# Altium project Thunderscope_Rev4.1.PrjPCB (part 2 of 2)

## Sheet FPGA.SchDoc: ThunderScope 1000E
size A4; DrawnBy: Aleksa Bjelogrlic; Revision: 1
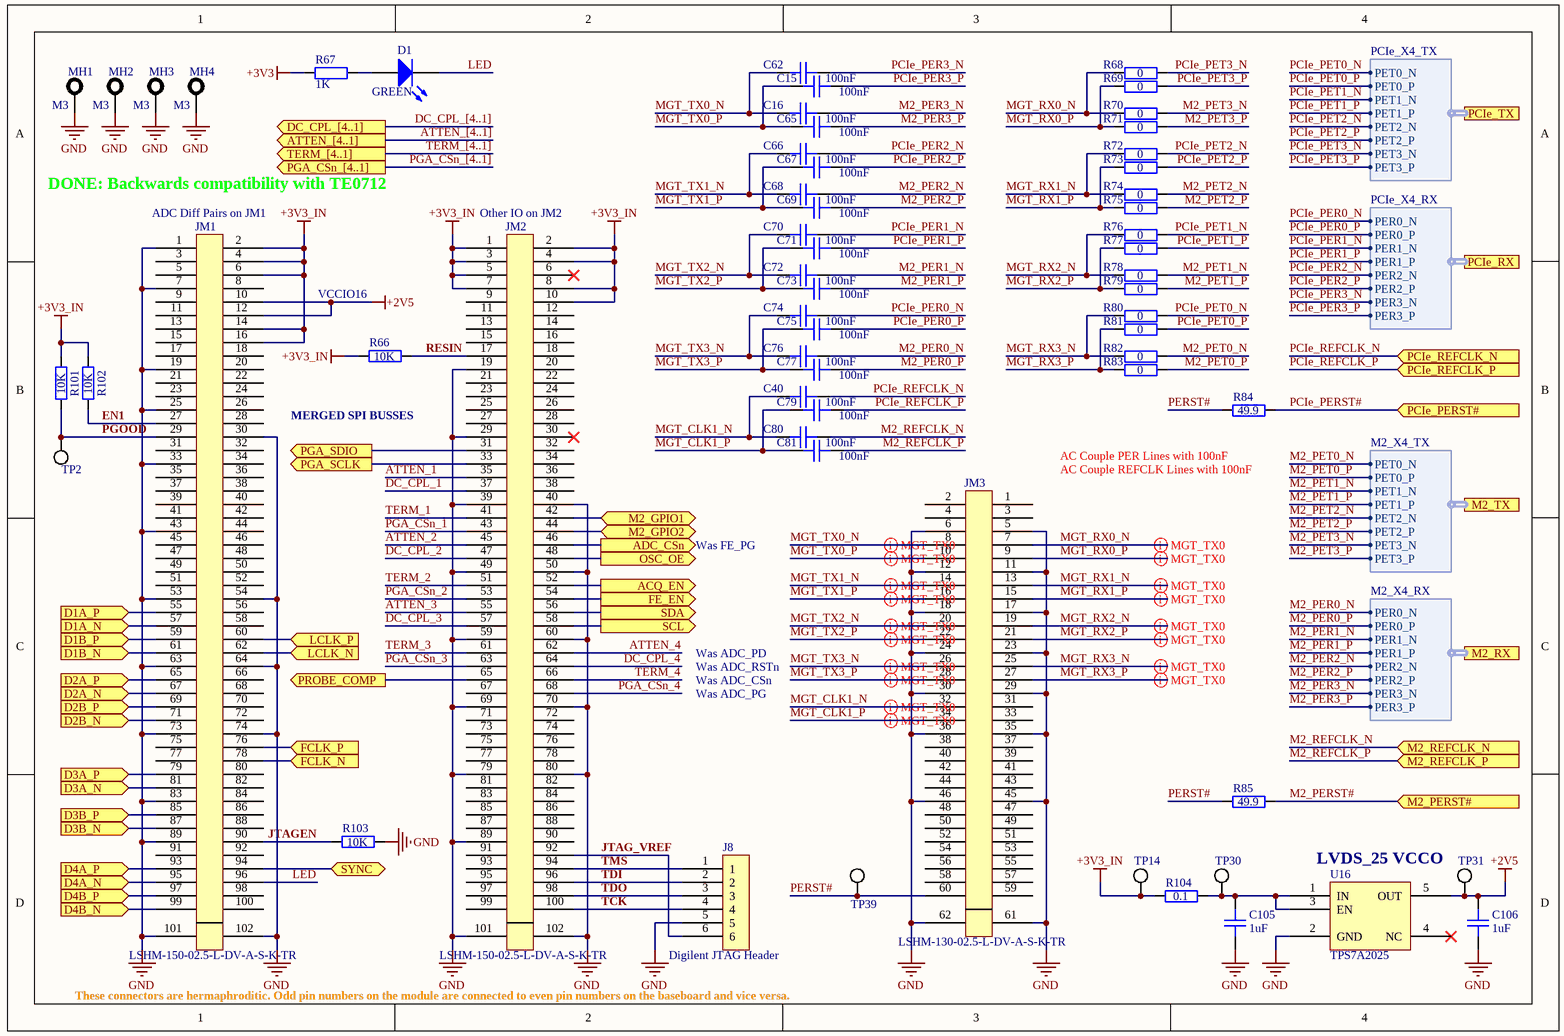
[diagram p5: FPGA.SchDoc]

### Parts
C15  100nF  [GEN_C_0201]
C16  100nF  [GEN_C_0201]
C40  100nF  [GEN_C_0201]
C62  100nF  [GEN_C_0201]
C65  100nF  [GEN_C_0201]
C66  100nF  [GEN_C_0201]
C67  100nF  [GEN_C_0201]
C68  100nF  [GEN_C_0201]
C69  100nF  [GEN_C_0201]
C70  100nF  [GEN_C_0201]
C71  100nF  [GEN_C_0201]
C72  100nF  [GEN_C_0201]
C73  100nF  [GEN_C_0201]
C74  100nF  [GEN_C_0201]
C75  100nF  [GEN_C_0201]
C76  100nF  [GEN_C_0201]
C77  100nF  [GEN_C_0201]
C79  100nF  [GEN_C_0201]
C80  100nF  [GEN_C_0201]
C81  100nF  [GEN_C_0201]
C105  1uF  [GEN_C_0402]
C106  1uF  [GEN_C_0402]
D1  GREEN  [LED_0603_LTST-S270K]
J8  2.54mm 6 Pin TH  [GEN_2.54mm_6_Pin_TH_RA]  (value not drawn)
JM1  LSHM-150-02.5-L-DV-A-S-K-TR  [SAM_LSHM-150-XX.X-XX-DV-A-S]
JM2  LSHM-150-02.5-L-DV-A-S-K-TR  [SAM_LSHM-150-XX.X-XX-DV-A-S]
JM3  LSHM-130-02.5-L-DV-A-S-K-TR  [SAM_LSHM-130-XX.X-XX-DV-A-S]
MH1  M3  [MH M3]  (no BOM)
MH2  M3  [MH M3]  (no BOM)
MH3  M3  [MH M3]  (no BOM)
MH4  M3  [MH M3]  (no BOM)
R66  10K  [GEN_R_0402]
R67  1K  [GEN_R_0402]
R68  0  [GEN_R_0201]
R69  0  [GEN_R_0201]
R70  0  [GEN_R_0201]
R71  0  [GEN_R_0201]
R72  0  [GEN_R_0201]
R73  0  [GEN_R_0201]
R74  0  [GEN_R_0201]
R75  0  [GEN_R_0201]
R76  0  [GEN_R_0201]
R77  0  [GEN_R_0201]
R78  0  [GEN_R_0201]
R79  0  [GEN_R_0201]
R80  0  [GEN_R_0201]
R81  0  [GEN_R_0201]
R82  0  [GEN_R_0201]
R83  0  [GEN_R_0201]
R84  49.9  [GEN_R_0402]
R85  49.9  [GEN_R_0402]
R101  10K  [GEN_R_0402]
R102  10K  [GEN_R_0402]
R103  10K  [GEN_R_0402]
R104  0.1  [GEN_R_0402]
TP2  PCB  [GEN_TP_PCB]  (value not drawn)  (no BOM)
TP14  PCB  [GEN_TP_PCB]  (value not drawn)  (no BOM)
TP30  PCB  [GEN_TP_PCB]  (value not drawn)  (no BOM)
TP31  PCB  [GEN_TP_PCB]  (value not drawn)  (no BOM)
TP39  PCB  [GEN_TP_PCB]  (value not drawn)  (no BOM)
U16  TPS7A2025  [GEN_SOT23_5_950_2900X1600X1450]

### Ports
ACQ_EN (out), ADC_CSn (out), ATTEN_[4..1] (out), D1A_N (in), D1A_P (in), D1B_N (in), D1B_P (in), D2A_N (in), D2A_P (in), D2B_N (in), D2B_P (in), D3A_N (in), D3A_P (in), D3B_N (in), D3B_P (in), D4A_N (in), D4A_P (in), D4B_N (in), D4B_P (in), DC_CPL_[4..1] (out), FCLK_N (in), FCLK_P (in), FE_EN (out), LCLK_N (in), LCLK_P (in), M2_GPIO1 (bidir), M2_GPIO2 (bidir), M2_PERST# (in), M2_REFCLK_N (in), M2_REFCLK_P (in), M2_RX (harness M2_X4_RX), M2_TX (harness M2_X4_TX), OSC_OE (out), PCIe_PERST# (in), PCIe_REFCLK_N (in), PCIe_REFCLK_P (in), PCIe_RX (harness PCIe_X4_RX), PCIe_TX (harness PCIe_X4_TX), PGA_CSn_[4..1] (out), PGA_SCLK (out), PGA_SDIO (out), PROBE_COMP (out), SCL (out), SDA (out), SYNC (bidir), TERM_[4..1] (out)

### Harnesses
PCIe_X4_RX: PER0_N, PER0_P, PER1_N, PER1_P, PER2_N, PER2_P, PER3_N, PER3_P
PCIe_X4_TX: PET0_N, PET0_P, PET1_N, PET1_P, PET2_N, PET2_P, PET3_N, PET3_P
M2_X4_RX: PER0_N, PER0_P, PER1_N, PER1_P, PER2_N, PER2_P, PER3_N, PER3_P
M2_X4_TX: PET0_N, PET0_P, PET1_N, PET1_P, PET2_N, PET2_P, PET3_N, PET3_P

### Nets
+2V5: C106.2 JM1.10 JM1.12 TP31.1 U16.5(OUT)
+3V3: R67.2
+3V3_IN: JM1.2 JM1.4 JM1.6 JM1.14 JM1.16 JM2.1 JM2.2 JM2.3 JM2.4 JM2.5 JM2.7 JM2.8 JM2.10 R66.2 R101.2 R102.2 R104.1 TP14.1
GND: C105.1 C106.1 J8.5 JM1.1 JM1.7 JM1.19 JM1.25 JM1.30 JM1.33 JM1.43 JM1.53 JM1.54 JM1.63 JM1.64 JM1.73 JM1.74 JM1.83 JM1.89 JM1.101 JM1.102 JM2.19 JM2.29 JM2.39 JM2.40 JM2.49 JM2.50 JM2.59 JM2.60 JM2.69 JM2.70 JM2.79 JM2.80 JM2.89 JM2.101 JM2.102 JM3.5 JM3.6 JM3.11 JM3.12 JM3.17 JM3.18 JM3.23 JM3.24 JM3.29 JM3.30 JM3.35 JM3.36 JM3.45 JM3.46 JM3.61 JM3.62 MH1.1 MH2.1 MH3.1 MH4.1 R103.1 U16.2(GND)
ACQ_EN: JM2.52 ; port ACQ_EN
ADC_CSn: JM2.46 ; port ADC_CSn
ADC_SCLK: JM2.33 ; port PGA_SCLK
ADC_SDATA: JM2.31 ; port PGA_SDIO
ATTEN_1: JM2.35
ATTEN_2: JM2.45
ATTEN_3: JM2.55
ATTEN_4: JM2.62
D1A_N: JM1.57 ; port D1A_N
D1A_P: JM1.55 ; port D1A_P
D1B_N: JM1.61 ; port D1B_N
D1B_P: JM1.59 ; port D1B_P
D2A_N: JM1.67 ; port D2A_N
D2A_P: JM1.65 ; port D2A_P
D2B_N: JM1.71 ; port D2B_N
D2B_P: JM1.69 ; port D2B_P
D3A_N: JM1.81 ; port D3A_N
D3A_P: JM1.79 ; port D3A_P
D3B_N: JM1.87 ; port D3B_N
D3B_P: JM1.85 ; port D3B_P
D4A_N: JM1.95 ; port D4A_N
D4A_P: JM1.93 ; port D4A_P
D4B_N: JM1.99 ; port D4B_N
D4B_P: JM1.97 ; port D4B_P
DC_CPL_1: JM2.37
DC_CPL_2: JM2.47
DC_CPL_3: JM2.57
DC_CPL_4: JM2.64
EN1: JM1.27 R102.1
FCLK_N: JM1.78 ; port FCLK_N
FCLK_P: JM1.76 ; port FCLK_P
FE_EN: JM2.54 ; port FE_EN
JTAG_VREF: J8.6 JM2.92
JTAGEN: JM1.90 R103.2
LCLK_N: JM1.62 ; port LCLK_N
LCLK_P: JM1.60 ; port LCLK_P
LED: D1.1(K) JM1.96
M2_GPIO1: JM2.42 ; port M2_GPIO1
M2_GPIO2: JM2.44 ; port M2_GPIO2
M2_PER0_N: C76.1 ; port M2_RX.PER0_N
M2_PER0_P: C77.1 ; port M2_RX.PER0_P
M2_PER1_N: C72.1 ; port M2_RX.PER1_N
M2_PER1_P: C73.1 ; port M2_RX.PER1_P
M2_PER2_N: C68.1 ; port M2_RX.PER2_N
M2_PER2_P: C69.1 ; port M2_RX.PER2_P
M2_PER3_N: C16.1 ; port M2_RX.PER3_N
M2_PER3_P: C65.1 ; port M2_RX.PER3_P
M2_PERST#: R85.2 ; port M2_PERST#
M2_PET0_N: R82.2 ; port M2_TX.PET0_N
M2_PET0_P: R83.2 ; port M2_TX.PET0_P
M2_PET1_N: R78.2 ; port M2_TX.PET1_N
M2_PET1_P: R79.2 ; port M2_TX.PET1_P
M2_PET2_N: R74.2 ; port M2_TX.PET2_N
M2_PET2_P: R75.2 ; port M2_TX.PET2_P
M2_PET3_N: R70.2 ; port M2_TX.PET3_N
M2_PET3_P: R71.2 ; port M2_TX.PET3_P
M2_REFCLK_N: C80.1 ; port M2_REFCLK_N
M2_REFCLK_P: C81.1 ; port M2_REFCLK_P
MGT_CLK1_N: C40.2 C80.2 JM3.32
MGT_CLK1_P: C79.2 C81.2 JM3.34
MGT_RX0_N: JM3.7 R68.1 R70.1
MGT_RX0_P: JM3.9 R69.1 R71.1
MGT_RX1_N: JM3.13 R72.1 R74.1
MGT_RX1_P: JM3.15 R73.1 R75.1
MGT_RX2_N: JM3.19 R76.1 R78.1
MGT_RX2_P: JM3.21 R77.1 R79.1
MGT_RX3_N: JM3.25 R80.1 R82.1
MGT_RX3_P: JM3.27 R81.1 R83.1
MGT_TX0_N: C16.2 C62.2 JM3.8
MGT_TX0_P: C15.2 C65.2 JM3.10
MGT_TX1_N: C66.2 C68.2 JM3.14
MGT_TX1_P: C67.2 C69.2 JM3.16
MGT_TX2_N: C70.2 C72.2 JM3.20
MGT_TX2_P: C71.2 C73.2 JM3.22
MGT_TX3_N: C74.2 C76.2 JM3.26
MGT_TX3_P: C75.2 C77.2 JM3.28
PCIe_PER0_N: C74.1 ; port PCIe_RX.PER0_N
PCIe_PER0_P: C75.1 ; port PCIe_RX.PER0_P
PCIe_PER1_N: C70.1 ; port PCIe_RX.PER1_N
PCIe_PER1_P: C71.1 ; port PCIe_RX.PER1_P
PCIe_PER2_N: C66.1 ; port PCIe_RX.PER2_N
PCIe_PER2_P: C67.1 ; port PCIe_RX.PER2_P
PCIe_PER3_N: C62.1 ; port PCIe_RX.PER3_N
PCIe_PER3_P: C15.1 ; port PCIe_RX.PER3_P
PCIe_PERST#: R84.2 ; port PCIe_PERST#
PCIe_PET0_N: R80.2 ; port PCIe_TX.PET0_N
PCIe_PET0_P: R81.2 ; port PCIe_TX.PET0_P
PCIe_PET1_N: R76.2 ; port PCIe_TX.PET1_N
PCIe_PET1_P: R77.2 ; port PCIe_TX.PET1_P
PCIe_PET2_N: R72.2 ; port PCIe_TX.PET2_N
PCIe_PET2_P: R73.2 ; port PCIe_TX.PET2_P
PCIe_PET3_N: R68.2 ; port PCIe_TX.PET3_N
PCIe_PET3_P: R69.2 ; port PCIe_TX.PET3_P
PCIe_REFCLK_N: C40.1 ; port PCIe_REFCLK_N
PCIe_REFCLK_P: C79.1 ; port PCIe_REFCLK_P
PERST#: JM3.60 R84.1 R85.1 TP39.1
PGA_CSn_1: JM2.43
PGA_CSn_2: JM2.53
PGA_CSn_3: JM2.63
PGA_CSn_4: JM2.68
PGOOD: JM1.29 R101.1 TP2.1
PLL_RSTn: JM2.48 ; port OSC_OE
PROBE_COMP: JM2.65 ; port PROBE_COMP
RESIN: JM2.17 R66.1
SCL: JM2.58 ; port SCL
SDA: JM2.56 ; port SDA
SYNC: JM1.94 ; port SYNC
TCK: J8.4 JM2.100
TDI: J8.2 JM2.96
TDO: J8.3 JM2.98
TERM_1: JM2.41
TERM_2: JM2.51
TERM_3: JM2.61
TERM_4: JM2.66
TMS: J8.1 JM2.94
NetC105_2: C105.2 R104.2 TP30.1 U16.1(IN) U16.3(EN)
NetD1_2: D1.2(A) R67.1

Not connected (* = marked no-connect by the designer): JM1 3 5 8 9 11 13 15 17 18 20 21 22 23 24 26 28 31 32 34 35 36 37 38 39 40 41 42 44 45 46 47 48 49 50 51 52 56 58 66 68 70 72 75 77 80 82 84 86 88 91 92 98 100; JM2 6* 9 11 12 13 14 15 16 18 20 21 22 23 24 25 26 27 28 30* 32 34 36 38 67 71 72 73 74 75 76 77 78 81 82 83 84 85 86 87 88 90 91 93 95 97 99; JM3 1 2 3 4 31 33 37 38 39 40 41 42 43 44 47 48 49 50 51 52 53 54 55 56 57 58 59; U16 4(NC)*

### Buses and harness runs
bus ATTEN_[4..1] = port ATTEN_[4..1]
bus DC_CPL_[4..1] = port DC_CPL_[4..1]
bus PGA_CSn_[4..1] = port PGA_CSn_[4..1]
bus TERM_[4..1] = port TERM_[4..1]

### Layout directives
differential pair; differential pair class PCIe: MGT_CLK1_N, MGT_CLK1_P, MGT_RX0_N, MGT_RX0_P, MGT_RX1_N, MGT_RX1_P, MGT_RX2_N, MGT_RX2_P, MGT_RX3_N, MGT_RX3_P, MGT_TX0_N, MGT_TX0_P, MGT_TX1_N, MGT_TX1_P, MGT_TX2_N, MGT_TX2_P, MGT_TX3_N, MGT_TX3_P

### Notes on the sheet
- DONE: Backwards compatibility with TE0712
- (near JM1) ADC Diff Pairs on JM1
- (near JM2) Other IO on JM2
- VCCIO16
- MERGED SPI BUSSES
- (near R84) AC Couple PER Lines with 100nF
- AC Couple REFCLK Lines with 100nF
- Was FE_PG
- Was ADC_PD
- Was ADC_RSTn
- Was ADC_PG
- Was ADC_CSn
- (near U16) LVDS_25 VCCO
- (near J8) Digilent JTAG Header
- These connectors are hermaphroditic. Odd pin numbers on the module are connected to even pin numbers on the baseboard and vice versa.

### Library data of the parts
C15 C16 C40 C62 C65-C77 C79-C81 = CAP 100nF 6.3V X5R 0201: Voltage Rating: 6.3V; Package: 0201; Supplier 1: Digi-Key; Supplier Part Number 1: 490-3167-1-ND; Value: 100nF
C105 C106 = CAP 1uF 25V X5R 0402: Voltage Rating: 25V; Package: 0402; Supplier 1: Digi-Key; Supplier Part Number 1: 490-10017-1-ND; Value: 1uF
D1 = LED GREEN 0603 LTST-S270K: Supplier 1: Digi-Key; Supplier Part Number 1: 160-1478-1-ND
J8 = CONN 2.54mm 6 Pin TH RA: Supplier 1: Digi-Key; Supplier Part Number 1: 732-5339-ND
JM1 JM2 = CONN LSHM-150-02.5-L-DV-A-S-K-TR: Manufacturer: Samtec; Supplier 1: Digi-Key; Supplier Part Number 1: SAM14147DKR-ND; House Part Number: LSHM-150-02.5-L-DV-A-S-K-TR; Manufacturer Part Number: LSHM-150-02.5-L-DV-A-S-K-TR
JM3 = CONN LSHM-130-02.5-L-DV-A-S-K-TR: Manufacturer: Samtec; Supplier 1: Digi-Key; Supplier Part Number 1: SAM14106DKR-ND; House Part Number: LSHM-130-02.5-L-DV-A-S-K-TR; Manufacturer Part Number: LSHM-130-02.5-L-DV-A-S-K-TR
MH1-MH4 = MH M3
R66 R101-R103 = RES 10K OHM 1% 1/10W 0402: Tolerance: 1%; Power Rating: 0.1W; Package: 0402; Supplier 1: Digi-Key; Supplier Part Number 1: P10.0KLCT-ND; Value: 10K
R67 = RES 1K OHM 1% 1/10W 0402: Tolerance: 1%; Power Rating: 0.1W; Package: 0402; Supplier 1: Digi-Key; Supplier Part Number 1: 311-1.00KLRCT-ND; Value: 1K
R68-R83 = RES 0 OHM 1% 1/20W 0201: Power Rating: 0.05W; Tolerance: 1%; Package: 0201; Supplier 1: Digi-Key; Supplier Part Number 1: RMCF0201ZT0R00CT-ND; Value: 0
R84 R85 = RES 49.9 OHM 1% 1/10W 0402: Tolerance: 1%; Power Rating: 0.1W; Package: 0402; Supplier 1: Digi-Key; Supplier Part Number 1: 311-49.9LRCT-ND; Value: 49.9
R104 = RES 0.1 OHM 1% 1/6W 0402: Tolerance: 1%; Power Rating: 0.16W; Package: 0402; Supplier 1: Digi-Key; Supplier Part Number 1: P.10AKCT-ND; Value: 0.1
TP2 TP14 TP30 TP31 TP39 = TP PCB 1mm
U16 = IC LDO TPS7A2025: Supplier 1: Digi-Key; Supplier Part Number 1: 296-TPS7A2025PDBVRCT-ND

## Sheet M2_KEY_M.SchDoc: ThunderScope 1000E
size A4
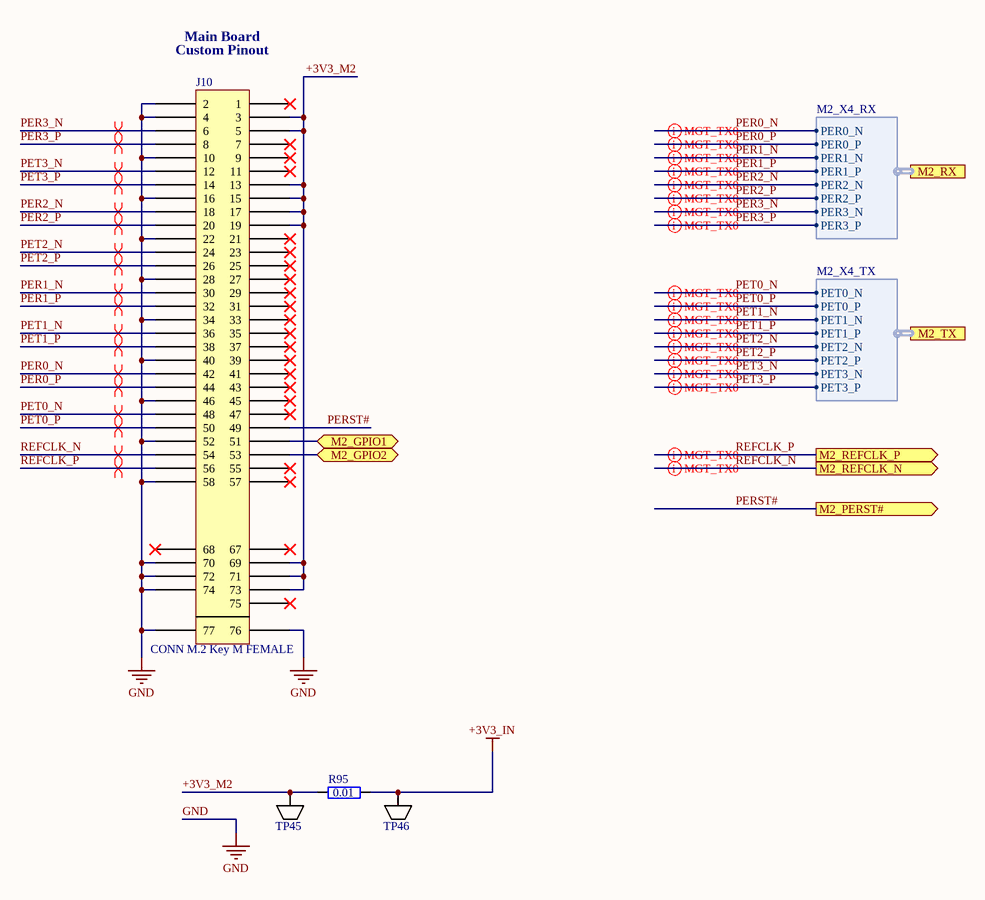
[diagram p6: M2_KEY_M.SchDoc]

### Parts
J10  CONN M.2 Key M FEMALE  [TE_M2_KEYM_2199230]
R95  0.01  [GEN_R_0603]
TP45  5015  [KEY_5015]  (value not drawn)
TP46  5015  [KEY_5015]  (value not drawn)

### Ports
M2_GPIO1 (bidir), M2_GPIO2 (bidir), M2_PERST# (out), M2_REFCLK_N (out), M2_REFCLK_P (out), M2_RX (harness M2_X4_RX), M2_TX (harness M2_X4_TX)

### Harnesses
M2_X4_RX: PER0_N, PER0_P, PER1_N, PER1_P, PER2_N, PER2_P, PER3_N, PER3_P
M2_X4_TX: PET0_N, PET0_P, PET1_N, PET1_P, PET2_N, PET2_P, PET3_N, PET3_P

### Nets
+3V3_IN: R95.2 TP46.1
GND: J10.2 J10.4 J10.10 J10.16 J10.22 J10.28 J10.34 J10.40 J10.46 J10.52 J10.58 J10.70 J10.72 J10.74 J10.76 J10.77
+3V3_M2: J10.3 J10.5 J10.13 J10.15 J10.17 J10.19 J10.69 J10.71 J10.73 R95.1 TP45.1
M2_GPIO1: J10.51 ; port M2_GPIO1
M2_GPIO2: J10.53 ; port M2_GPIO2
PER0_N: J10.42 ; port M2_RX.PER0_N  [project net M2_PER0_N]
PER0_P: J10.44 ; port M2_RX.PER0_P  [project net M2_PER0_P]
PER1_N: J10.30 ; port M2_RX.PER1_N  [project net M2_PER1_N]
PER1_P: J10.32 ; port M2_RX.PER1_P  [project net M2_PER1_P]
PER2_N: J10.18 ; port M2_RX.PER2_N  [project net M2_PER2_N]
PER2_P: J10.20 ; port M2_RX.PER2_P  [project net M2_PER2_P]
PER3_N: J10.6 ; port M2_RX.PER3_N  [project net M2_PER3_N]
PER3_P: J10.8 ; port M2_RX.PER3_P  [project net M2_PER3_P]
PERST#: J10.49 ; port M2_PERST#  [project net M2_PERST#]
PET0_N: J10.48 ; port M2_TX.PET0_N  [project net M2_PET0_N]
PET0_P: J10.50 ; port M2_TX.PET0_P  [project net M2_PET0_P]
PET1_N: J10.36 ; port M2_TX.PET1_N  [project net M2_PET1_N]
PET1_P: J10.38 ; port M2_TX.PET1_P  [project net M2_PET1_P]
PET2_N: J10.24 ; port M2_TX.PET2_N  [project net M2_PET2_N]
PET2_P: J10.26 ; port M2_TX.PET2_P  [project net M2_PET2_P]
PET3_N: J10.12 ; port M2_TX.PET3_N  [project net M2_PET3_N]
PET3_P: J10.14 ; port M2_TX.PET3_P  [project net M2_PET3_P]
REFCLK_N: J10.54 ; port M2_REFCLK_N  [project net M2_REFCLK_N]
REFCLK_P: J10.56 ; port M2_REFCLK_P  [project net M2_REFCLK_P]

Not connected (* = marked no-connect by the designer): J10 1* 7* 9* 11* 21* 23* 25* 27* 29* 31* 33* 35* 37* 39* 41* 43* 45* 47* 55* 57* 67* 68* 75*

### Layout directives
differential pair; differential pair class PCIe: M2_PER0_N, M2_PER0_P, M2_PER1_N, M2_PER1_P, M2_PER2_N, M2_PER2_P, M2_PER3_N, M2_PER3_P, M2_PET0_N, M2_PET0_P, M2_PET1_N, M2_PET1_P, M2_PET2_N, M2_PET2_P, M2_PET3_N, M2_PET3_P, M2_REFCLK_N, M2_REFCLK_P

### Notes on the sheet
- Main Board
- (near J10) Custom Pinout

### Library data of the parts
R95 = RES 0.01 OHM 1% 1/4W 0603: Tolerance: 1%; Power Rating: 0.25W; Supplier 1: Digi-Key; Supplier Part Number 1: 408-1404-1-ND; Value: 0.01; Package: 0603
TP45 TP46 = TP KEYSTONE 5015: Supplier 1: Digi-Key; Supplier Part Number 1: 36-5015CT-ND
J10 = CONN M.2 Key M FEMALE: Supplier 1: Digi-Key; Supplier Part Number 1: A124992CT-ND

## Sheet PWR.SchDoc: ThunderScope 1000E
size A4
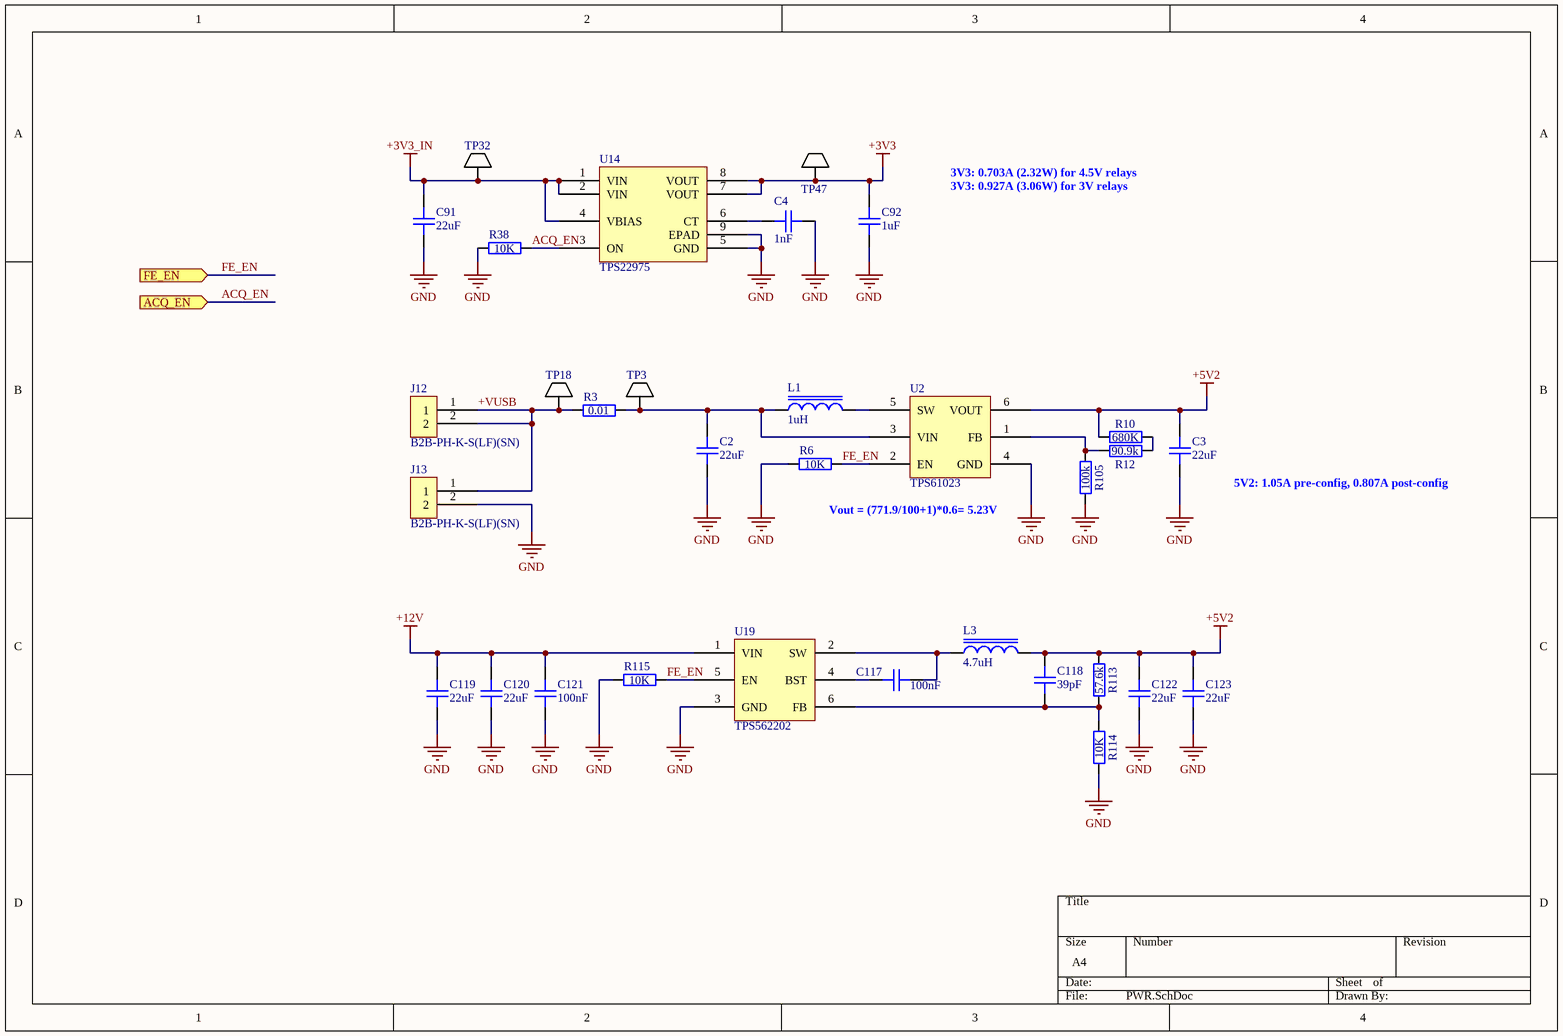
[diagram p7: PWR.SchDoc]

### Parts
C2  22uF  [GEN_C_0805]
C3  22uF  [GEN_C_0805]
C4  1nF  [GEN_C_0402]
C91  22uF  [GEN_C_0805]
C92  1uF  [GEN_C_0402]
C117  100nF  [GEN_C_0402]
C118  39pF  [GEN_C_0402]
C119  22uF  [GEN_C_0805]
C120  22uF  [GEN_C_0805]
C121  100nF  [GEN_C_0402]
C122  22uF  [GEN_C_0805]
C123  22uF  [GEN_C_0805]
J12  B2B-PH-K-S(LF)(SN)  [JST_B2B-PH-K-S(LF)(SN)]
J13  B2B-PH-K-S(LF)(SN)  [JST_B2B-PH-K-S(LF)(SN)]
L1  1uH  [GEN_L_1210]
L3  4.7uH  [TY_IND_NRS5030]
R3  0.01  [GEN_R_0603]
R6  10K  [GEN_R_0402]
R10  680K  [GEN_R_0402]
R12  90.9k  [GEN_R_0402]
R38  10K  [GEN_R_0402]
R105  100k  [GEN_R_0402]
R113  57.6k  [GEN_R_0402]
R114  10K  [GEN_R_0402]
R115  10K  [GEN_R_0402]
TP3  5015  [KEY_5015]  (value not drawn)
TP18  5015  [KEY_5015]  (value not drawn)
TP32  5015  [KEY_5015]  (value not drawn)
TP47  5015  [KEY_5015]  (value not drawn)
U2  TPS61023  [TI_SOT563_DRL0006A]
U14  TPS22975  [TI_WSON8_DSG0008A]
U19  TPS562202  [TI_SOT563_DRL0006A]

### Ports
ACQ_EN (in), FE_EN (in)

### Nets
+3V3: C92.2 TP47.1 U14.7(VOUT) U14.8(VOUT)
+3V3_IN: C91.2 TP32.1 U14.1(VIN) U14.2(VIN) U14.4(VBIAS)
+5V2: C3.2 C118.2 C122.2 C123.2 L3.2 R10.2 R113.2 U2.6(VOUT)
+12V: C119.2 C120.2 C121.1 U19.1(VIN)
GND: C2.1 C3.1 C4.1 C91.1 C92.1 C119.1 C120.1 C121.2 C122.1 C123.1 J13.2 R6.2 R38.1 R105.1 R114.1 R115.2 U2.4(GND) U14.5(GND) U14.9(EPAD) U19.3(GND)
+VUSB: J12.1 J12.2 J13.1 R3.2 TP18.1
ACQ_EN: R38.2 U14.3(ON) ; port ACQ_EN
FE_EN: R6.1 R115.1 U2.2(EN) U19.5(EN) ; port FE_EN
NetC2_2: C2.2 L1.1 R3.1 TP3.1 U2.3(VIN)
NetC4_2: C4.2 U14.6(CT)
NetC117_1: C117.1 L3.1 U19.2(SW)
NetC117_2: C117.2 U19.4(BST)
NetC118_1: C118.1 R113.1 R114.2 U19.6(FB)
NetL1_2: L1.2 U2.5(SW)
NetR10_1: R10.1 R12.2
NetR12_1: R12.1 R105.2 U2.1(FB)

### Notes on the sheet
- 3V3: 0.703A (2.32W) for 4.5V relays
- 3V3: 0.927A (3.06W) for 3V relays
- Vout = (771.9/100+1)*0.6= 5.23V
- 5V2: 1.05A pre-config, 0.807A post-config

### Library data of the parts
C2 C3 C91 C119 C120 C122 C123 = CAP 22uF 25V X5R 0805: Voltage Rating: 25V; Package: 0805; Value: 22uF; Supplier 1: Digi-Key; Supplier Part Number 1: 490-10749-1-ND
C4 = CAP 1nF 50V C0G 0402: Voltage Rating: 50V; Package: 0402; Supplier 1: Digi-Key; Supplier Part Number 1: 490-6189-1-ND; Value: 1nF
C92 = CAP 1uF 25V X5R 0402: Voltage Rating: 25V; Package: 0402; Value: 1uF; Supplier 1: Digi-Key; Supplier Part Number 1: 490-10017-1-ND
C117 C121 = CAP 100nF 16V X7R 0402: Voltage Rating: 16V; Package: 0402; Supplier 1: Digi-Key; Supplier Part Number 1: 490-4759-1-ND; Value: 100nF
C118 = CAP 39pF 50V C0G 0402: Manufacturer: KEMET; House Part Number: C-39pF-0402-002; Manufacturer Part Number: C0402C390J5GACTU; Temperature Coefficient: C0G; Voltage Rating: 50V; Package: 0402; Value: 39pF; Supplier 1: Digi-Key; Supplier Part Number 1: 399-C0402C390J5GAC7867CT-ND
J12 J13 = CONN JST PH 2 Pin TH: Supplier 1: Digi-Key; Supplier Part Number 1: 455-1704-ND
L1 = IND 1uH 3.1A 45 MOHM 1210: Value: 1uH; Supplier 1: Digi-Key; Supplier Part Number 1: 490-10590-1-ND
L3 = IND 4.7uH 2.6A 35 MOHM SMD: Value: 4.7uH; Supplier 1: Digi-Key; Supplier Part Number 1: 587-3461-1-ND
R3 = RES 0.01 OHM 1% 1/4W 0603: Tolerance: 1%; Power Rating: 0.25W; Supplier 1: Digi-Key; Supplier Part Number 1: 408-1404-1-ND; Value: 0.01; Package: 0603
R6 R38 R114 R115 = RES 10K OHM 1% 1/10W 0402: Tolerance: 1%; Power Rating: 0.1W; Package: 0402; Supplier 1: Digi-Key; Supplier Part Number 1: P10.0KLCT-ND; Value: 10K
R10 = RES 680K OHM 1% 1/16W 0402: Manufacturer: Yageo; Manufacturer Part Number: RC0402FR-07681KL; Tolerance: 1%; Package: 0402; Supplier 1: Digi-Key; Supplier Part Number 1: YAG3211CT-ND; Value: 680K
R12 = RES 90.9K OHM 1% 1/16W 0402: Tolerance: 1%; Power Rating: 0.0625W; Package: 0402; Supplier 1: Digi-Key; Supplier Part Number 1: 311-90.9KLRCT-ND; Value: 90.9k
R105 = RES 100K OHM 1% 1/10W 0402: Tolerance: 1%; Power Rating: 0.1W; Package: 0402; Supplier 1: Digi-Key; Supplier Part Number 1: 311-100KLRCT-ND; Value: 100k
R113 = RES 57.6K OHM 1% 1/16W 0402: Tolerance: 1%; Power Rating: 0.0625W; Package: 0402; Value: 57.6k; Supplier 1: Digi-Key; Supplier Part Number 1: YAG3190CT-ND
TP3 TP18 TP32 TP47 = TP KEYSTONE 5015: Supplier 1: Digi-Key; Supplier Part Number 1: 36-5015CT-ND
U2 = IC BOOST TPS61023: Supplier 1: Digi-Key; Supplier Part Number 1: 296-TPS61023DRLTCT-ND
U14 = IC SWITCH LOAD TPS22975: Supplier 1: Digi-Key; Supplier Part Number 1: 296-47228-1-ND
U19 = IC BUCK TPS562202: Supplier 1: Digi-Key; Supplier Part Number 1: 296-TPS562202DRLRCT-ND

## Nets that join several sheets
+1V8APLL: ADC (FB3.2), PLL (21 pins)
+3V3: Main (C1.1 R110.1 U1.5), FE (Q1.2 Q2.2 R20.2 R21.2), Front End/CH1 (D2A.1 D3A.1 K1A.1 K2A.1), Front End/CH2 (D2B.1 D3B.1 K1B.1 K2B.1), Front End/CH3 (D2C.1 D3C.1 K1C.1 K2C.1), Front End/CH4 (D2D.1 D3D.1 K1D.1 K2D.1), ADC (9 pins), PLL (7 pins), FPGA (R67.2), PWR (C92.2 TP47.1 U14.7 U14.8)
+3V3_IN: FPGA (18 pins), M2_KEY_M (R95.2 TP46.1), PWR (5 pins)
+3V3_PGA: FE (C126.2 TP53.1 U20.5), Front End/CH1 (C36A.2 R51A.2 U7A.12), Front End/CH2 (C36B.2 R51B.2 U7B.12), Front End/CH3 (C36C.2 R51C.2 U7C.12), Front End/CH4 (C36D.2 R51D.2 U7D.12)
+5V: FE (18 pins), Front End/CH1 (C111A.2 C132A.2 FB8A.2 FB9A.1), Front End/CH2 (C111B.2 C132B.2 FB8B.2 FB9B.1), Front End/CH3 (C111C.2 C132C.2 FB8C.2 FB9C.1), Front End/CH4 (C111D.2 C132D.2 FB8D.2 FB9D.1)
+5V2: FE (R7.1 R8.1 TP13.1), PWR (8 pins)
+VBIAS: FE (R16.1 TP17.1 U8.2 U8.6), Front End/CH1 (C130A.1 FB6A.1), Front End/CH2 (C130B.1 FB6B.1), Front End/CH3 (C130C.1 FB6C.1), Front End/CH4 (C130D.1 FB6D.1)
-5V: FE (6 pins), Front End/CH1 (C133A.1 FB10A.1), Front End/CH2 (C133B.1 FB10B.1), Front End/CH3 (C133C.1 FB10C.1), Front End/CH4 (C133D.1 FB10D.1)
-VBIAS: FE (C100.1 R14.2 TP19.1 U5.6), Front End/CH1 (C129A.1 FB4A.2), Front End/CH2 (C129B.1 FB4B.2), Front End/CH3 (C129C.1 FB4C.2), Front End/CH4 (C129D.1 FB4D.2)
GND: Main (20 pins), FE (28 pins), Front End/CH1 (51 pins), Front End/CH2 (51 pins), Front End/CH3 (51 pins), Front End/CH4 (51 pins), ADC (35 pins), PLL (24 pins), FPGA (57 pins), M2_KEY_M (16 pins), PWR (20 pins)
ACQ_EN: Main (TP33.1), FPGA (JM2.52), PWR (R38.2 U14.3)
ADC_CLK_N: ADC (C104.2 J5.1), PLL (U15.48)
ADC_CLK_P: ADC (C103.2 J6.1), PLL (U15.47)
ADC_CSn: ADC (R42.1 TP29.1 U12.2), FPGA (JM2.46)
ADC_SCLK: Front End/CH1 (U7A.11), Front End/CH2 (U7B.11), Front End/CH3 (U7C.11), Front End/CH4 (U7D.11), ADC (TP35.1 U12.4), FPGA (JM2.33)
ADC_SDATA: Front End/CH1 (U7A.10), Front End/CH2 (U7B.10), Front End/CH3 (U7C.10), Front End/CH4 (U7D.10), ADC (TP34.1 U12.3), FPGA (JM2.31)
ATTEN_1: Front End/CH1 (R47A.2 R49A.2 TP22A.1), FPGA (JM2.35)
ATTEN_2: Front End/CH2 (R47B.2 R49B.2 TP22B.1), FPGA (JM2.45)
ATTEN_3: Front End/CH3 (R47C.2 R49C.2 TP22C.1), FPGA (JM2.55)
ATTEN_4: Front End/CH4 (R47D.2 R49D.2 TP22D.1), FPGA (JM2.62)
CH1_N: Front End/CH1 (R97A.2), ADC (R57.2 U12.47)
CH1_P: Front End/CH1 (R52A.2), ADC (R57.1 U12.46)
CH2_N: Front End/CH2 (R97B.2), ADC (R60.2 U12.44)
CH2_P: Front End/CH2 (R52B.2), ADC (R60.1 U12.43)
CH3_N: Front End/CH3 (R97C.2), ADC (R62.2 U12.41)
CH3_P: Front End/CH3 (R52C.2), ADC (R62.1 U12.40)
CH4_N: Front End/CH4 (R97D.2), ADC (R63.2 U12.38)
CH4_P: Front End/CH4 (R52D.2), ADC (R63.1 U12.37)
D1A_N: ADC (U12.10), FPGA (JM1.57)
D1A_P: ADC (U12.9), FPGA (JM1.55)
D1B_N: ADC (U12.12), FPGA (JM1.61)
D1B_P: ADC (U12.11), FPGA (JM1.59)
D2A_N: ADC (U12.14), FPGA (JM1.67)
D2A_P: ADC (U12.13), FPGA (JM1.65)
D2B_N: ADC (U12.16), FPGA (JM1.71)
D2B_P: ADC (U12.15), FPGA (JM1.69)
D3A_N: ADC (U12.22), FPGA (JM1.81)
D3A_P: ADC (U12.21), FPGA (JM1.79)
D3B_N: ADC (U12.24), FPGA (JM1.87)
D3B_P: ADC (U12.23), FPGA (JM1.85)
D4A_N: ADC (U12.26), FPGA (JM1.95)
D4A_P: ADC (U12.25), FPGA (JM1.93)
D4B_N: ADC (U12.28), FPGA (JM1.99)
D4B_P: ADC (U12.27), FPGA (JM1.97)
DC_CPL_1: Front End/CH1 (R126A.2 R127A.2 TP26A.1), FPGA (JM2.37)
DC_CPL_2: Front End/CH2 (R126B.2 R127B.2 TP26B.1), FPGA (JM2.47)
DC_CPL_3: Front End/CH3 (R126C.2 R127C.2 TP26C.1), FPGA (JM2.57)
DC_CPL_4: Front End/CH4 (R126D.2 R127D.2 TP26D.1), FPGA (JM2.64)
FCLK_N: ADC (U12.20), FPGA (JM1.78)
FCLK_P: ADC (U12.19), FPGA (JM1.76)
FE_EN: Main (TP7.1), FPGA (JM2.54), PWR (R6.1 R115.1 U2.2 U19.5)
LCLK_N: ADC (U12.18), FPGA (JM1.62)
LCLK_P: ADC (U12.17), FPGA (JM1.60)
M2_GPIO1: FPGA (JM2.42), M2_KEY_M (J10.51)
M2_GPIO2: FPGA (JM2.44), M2_KEY_M (J10.53)
M2_PER0_N: FPGA (C76.1), M2_KEY_M (J10.42)
M2_PER0_P: FPGA (C77.1), M2_KEY_M (J10.44)
M2_PER1_N: FPGA (C72.1), M2_KEY_M (J10.30)
M2_PER1_P: FPGA (C73.1), M2_KEY_M (J10.32)
M2_PER2_N: FPGA (C68.1), M2_KEY_M (J10.18)
M2_PER2_P: FPGA (C69.1), M2_KEY_M (J10.20)
M2_PER3_N: FPGA (C16.1), M2_KEY_M (J10.6)
M2_PER3_P: FPGA (C65.1), M2_KEY_M (J10.8)
M2_PERST#: FPGA (R85.2), M2_KEY_M (J10.49)
M2_PET0_N: FPGA (R82.2), M2_KEY_M (J10.48)
M2_PET0_P: FPGA (R83.2), M2_KEY_M (J10.50)
M2_PET1_N: FPGA (R78.2), M2_KEY_M (J10.36)
M2_PET1_P: FPGA (R79.2), M2_KEY_M (J10.38)
M2_PET2_N: FPGA (R74.2), M2_KEY_M (J10.24)
M2_PET2_P: FPGA (R75.2), M2_KEY_M (J10.26)
M2_PET3_N: FPGA (R70.2), M2_KEY_M (J10.12)
M2_PET3_P: FPGA (R71.2), M2_KEY_M (J10.14)
M2_REFCLK_N: FPGA (C80.1), M2_KEY_M (J10.54)
M2_REFCLK_P: FPGA (C81.1), M2_KEY_M (J10.56)
PGA_CSn_1: Front End/CH1 (R51A.1 TP24A.1 U7A.9), FPGA (JM2.43)
PGA_CSn_2: Front End/CH2 (R51B.1 TP24B.1 U7B.9), FPGA (JM2.53)
PGA_CSn_3: Front End/CH3 (R51C.1 TP24C.1 U7C.9), FPGA (JM2.63)
PGA_CSn_4: Front End/CH4 (R51D.1 TP24D.1 U7D.9), FPGA (JM2.68)
PLL_RSTn: PLL (R28.2 R89.1 TP44.1), FPGA (JM2.48)
PROBE_COMP: Main (R2.2 U1.2), FPGA (JM2.65)
REFINOUT: Main (R106.2 R107.2), PLL (C96.2 R88.2)
SCL: FE (Q2.3 R21.1), PLL (R90.1 TP43.1 U15.24), FPGA (JM2.58)
SDA: FE (Q1.3 R20.1), PLL (R91.1 TP42.1 U15.25), FPGA (JM2.56)
SYNC: Main (R108.2 R109.2 R110.2), FPGA (JM1.94)
TERM_1: Front End/CH1 (R48A.2 R50A.2 TP23A.1), FPGA (JM2.41)
TERM_2: Front End/CH2 (R48B.2 R50B.2 TP23B.1), FPGA (JM2.51)
TERM_3: Front End/CH3 (R48C.2 R50C.2 TP23C.1), FPGA (JM2.61)
TERM_4: Front End/CH4 (R48D.2 R50D.2 TP23D.1), FPGA (JM2.66)
TRIM1: FE (R15.1 U17.1), Front End/CH1 (C131A.1 FB7A.1)
TRIM2: FE (R17.1 U17.8), Front End/CH2 (C131B.1 FB7B.1)
TRIM3: FE (R18.1 U17.9), Front End/CH3 (C131C.1 FB7C.1)
TRIM4: FE (R19.1 U17.14), Front End/CH4 (C131D.1 FB7D.1)
VCM: FE (TP16.1), Front End/CH1 (U7A.13), Front End/CH2 (U7B.13), Front End/CH3 (U7C.13), Front End/CH4 (U7D.13), ADC (C134.2 U12.48)

## Assembly variants
PCIe: not fitted C2 C3 C16 C65 C68 C69 C72 C73 C76 C77 C80 C81 C108 C109 C110 C111 D4 D5 FB7 J3A J3B J3C J3D J4A J4B J4C J4D J5 J6 J7 J9 J10 J12 J12 J13 L1 R3 R3 R4 R5 R6 R10 R12 R15 R17 R18 R19 R51A R51B R51C R51D R54A R54B R54C R54D R70 R71 R74 R75 R78 R79 R82 R83 R85 R95 R105 R106 R108 R1030A R1030B R1030C R1030D R1057A R1057B R1057C R1057D TP1 TP3 TP4 TP8 TP18 TP45 TP46 U2 U18
TB: not fitted C15 C40 C62 C66 C67 C70 C71 C74 C75 C79 C108 C109 C110 C117 C118 C119 C120 C121 C122 C123 D6 D7 FB7 J3A J3B J3C J3D J4A J4B J4C J4D J5 J6 J11 L3 R5 R15 R17 R18 R19 R51A R51B R51C R51D R54A R54B R54C R54D R68 R69 R72 R73 R76 R77 R80 R81 R84 R86 R87 R107 R109 R112 R113 R114 R115 R116 R1030A R1030B R1030C R1030D R1057A R1057B R1057C R1057D SHLD1 TP40 TP41 TP48 TP49 TP50 TP51 U18 U19